# Altium schematic sheet other.SchDoc
size A3
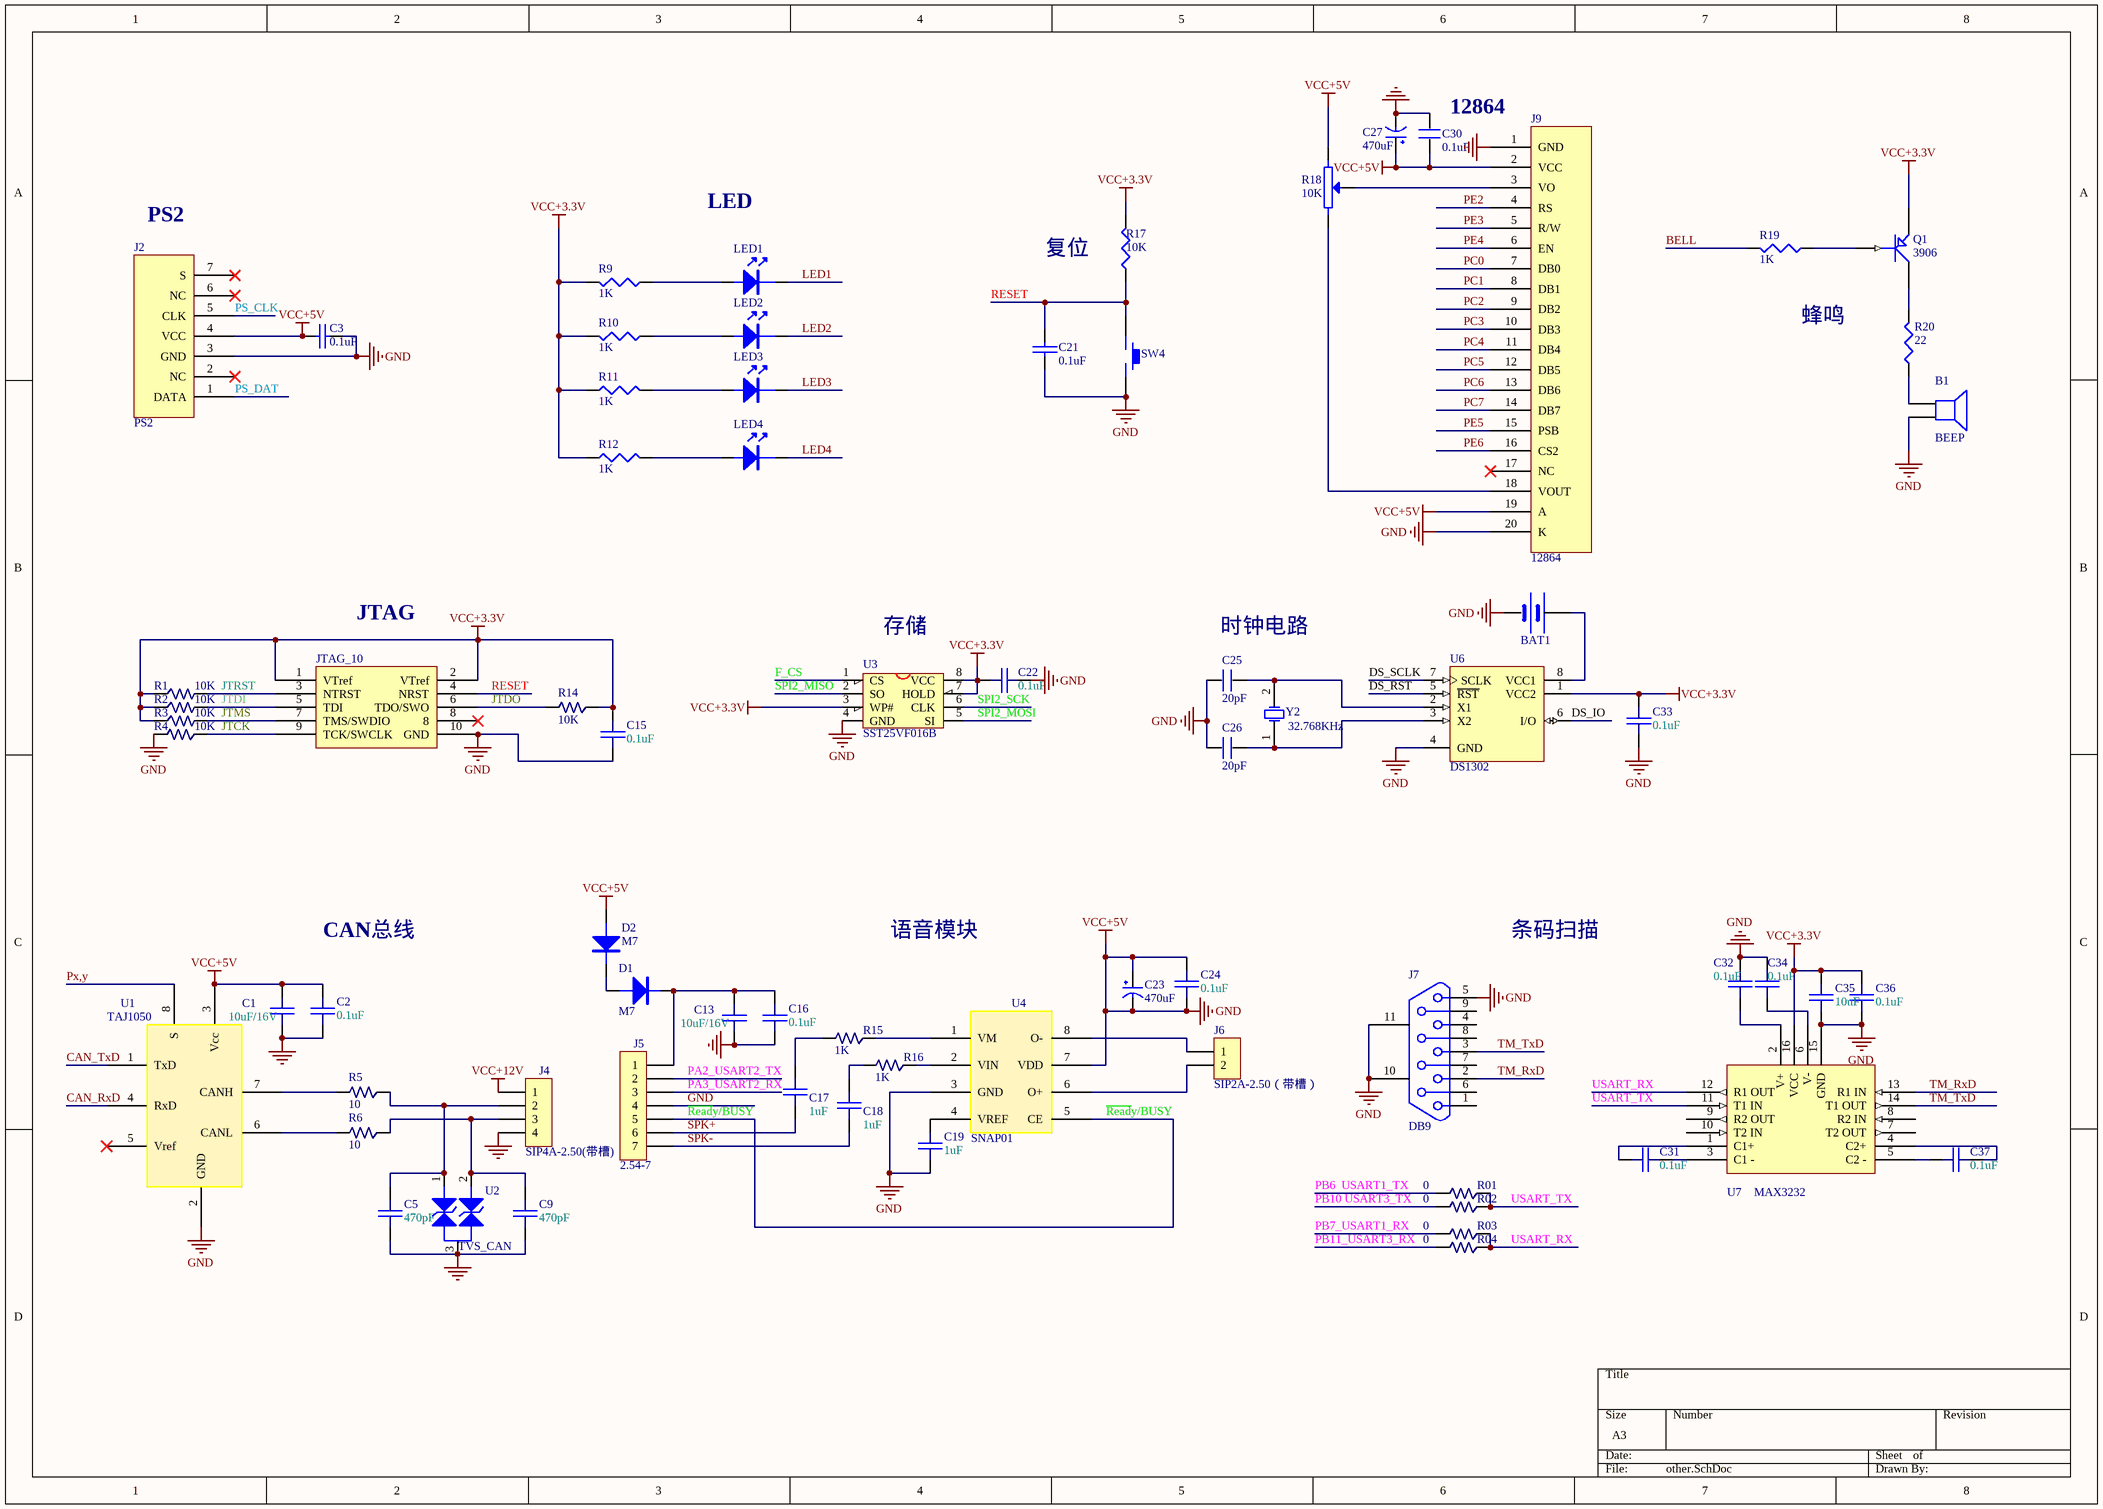
[diagram p0: other.SchDoc]

## Parts
B1  BEEP  [BEEP-12]
BAT1  BATT  [BATM]  (value not drawn)
C1  10uF/16V  [0805]
C2  0.1uF  [0603]
C3  0.1uF  [0603]
C5  470pF  [0603]
C9  470pF  [0603]
C13  10uF/16V  [0805]
C15  0.1uF  [0603]
C16  0.1uF  [0603]
C17  1uF  [0603]
C18  1uF  [0603]
C19  1uF  [0603]
C21  0.1uF  [0603]
C22  0.1uF  [0603]
C23  470uF  [RB5.0-8]
C24  0.1uF  [0603]
C25  20pF  [0603]
C26  20pF  [0603]
C27  470uF  [RB5.0-8]
C30  0.1uF  [0603]
C31  0.1uF  [0603]
C32  0.1uF  [0603]
C33  0.1uF  [0603]
C34  0.1uF  [0603]
C35  10uF  [0805]
C36  0.1uF  [0603]
C37  0.1uF  [0603]
D1  M7  [SMB]
D2  M7  [SMB]
J2  PS2  [PS2-6PIN]
J3  JTAG_10  [JTAG_10]
J4  SIP4A-2.50(带槽)  [5.08_4P]
J5  2.54-7  [SYN6288]
J6  SIP2A-2.50（带槽）  [2.54]
J7  DB9  [DB9/M]
J9  12864  [XH2.54-20P]
LED1  (no value)  [LED-0805]
LED2  (no value)  [LED-0805]
LED3  (no value)  [LED-0805]
LED4  (no value)  [LED-0805]
Q1  3906  [SOT-23]
R1  10K  [0603]
R01  0  [0603]
R2  10K  [0603]
R02  0  [0603]
R3  10K  [0603]
R03  0  [0603]
R4  10K  [0603]
R04  0  [0603]
R5  10  [0603]
R6  10  [0603]
R9  1K  [0603]
R10  1K  [0603]
R11  1K  [0603]
R12  1K  [0603]
R14  10K  [0603]
R15  1K  [0603]
R16  1K  [0603]
R17  10K  [0603]
R18  10K  [RM065-V1]
R19  1K  [0603]
R20  22  [0603]
SW4  KEY_M  [KEY_M]  (value not drawn)
U1  TAJ1050  [SO-8]
U2  TVS_CAN  [SOT-23]
U3  SST25VF016B  [SOIC-8]
U4  SNAP01  [sop-8]
U6  DS1302  [SOP-8]
U7  MAX3232  [SOP-16]
Y2  32.768KHz  [cs-308]

## Nets
GND: B1.2 BAT1.2(GND) C1.1 C1.2 C2.1 C2.2 C3.1 C3.2 C5.2 C9.2 C13.1 C15.2 C16.1 C19.2 C21.2 C22.2 C23.1(VCC) C23.2(GND) C24.1 C24.2 C25.1 C26.1 C27.1(VCC) C27.2(GND) C30.1 C30.2 C32.2 C33.1 C34.2 C35.1 C36.1 D2.1(A) J2.3(GND) J2.4(VCC) J3.10(GND) J4.4 J5.4 J7.5 J7.10 J7.11 J9.1(GND) J9.2(VCC) J9.19(A) J9.20(K) R4.2 R18.1 SW4.2 U1.2(GND) U1.3(Vcc) U2.3 U3.4(GND) U4.3(GND) U4.7(VDD) U6.4(GND) U7.15(GND)  [also labelled VCC+5V]
VCC+3.3V: C15.1 C22.1 C33.2 C35.2 C36.2 J3.1(VTref) J3.2(VTref) Q1.2(E) R1.1 R2.1 R3.1 R9.2 R10.2 R11.1 R12.1 R14.1 R17.2 U3.3(WP#) U3.7(HOLD) U3.8(VCC) U6.1(VCC2) U7.16(VCC)
VCC+12V: J4.1
BELL: R19.2
CAN_RxD: U1.4(RxD)
CAN_TxD: U1.1(TxD)
DS_IO: U6.6(I/O)
DS_RST: U6.5(~{RST})
DS_SCLK: U6.7(SCLK)
F_CS: U3.1(CS)
JTCK: J3.9(TCK/SWCLK) R4.1
JTDI: J3.5(TDI) R2.2
JTDO: J3.6(TDO/SWO) R14.2
JTMS: J3.7(TMS/SWDIO) R3.2
JTRST: J3.3(NTRST) R1.2
LED1: LED1.2
LED2: LED2.2
LED3: LED3.2
LED4: LED4.2
PA2_USART2_TX: J5.2
PA3_USART2_RX: J5.3
PB6  USART1_TX: R01.2
PB7_USART1_RX: R03.2
PB10 USART3_TX: R02.2
PB11_USART3_RX: R04.2
PC0: J9.7(DB0)
PC1: J9.8(DB1)
PC2: J9.9(DB2)
PC3: J9.10(DB3)
PC4: J9.11(DB4)
PC5: J9.12(DB5)
PC6: J9.13(DB6)
PC7: J9.14(DB7)
PE2: J9.4(RS)
PE3: J9.5(R/W)
PE4: J9.6(EN)
PE5: J9.15(PSB)
PE6: J9.16(CS2)
PS_CLK: J2.5(CLK)
PS_DAT: J2.1(DATA)
Px,y: U1.8(S)
~{Read}y/BUSY: J5.5 U4.5(CE)
RESET: C21.1 J3.4(NRST) R17.1 SW4.1
SPI2_MISO: U3.2(SO)
SPI2_MOSI: U3.5(SI)
SPI2_SCK: U3.6(CLK)
SPK+: C17.1 J5.6
SPK-: C18.1 J5.7
TM_RxD: J7.2 U7.13(R1_IN)
TM_TxD: J7.3 U7.14(T1_OUT)
USART_RX: R03.1 R04.1 U7.12(R1_OUT)
USART_TX: R01.1 R02.1 U7.11(T1_IN)
NetB1_1: B1.1 R20.1
NetBAT1_1: BAT1.1(VCC) U6.8(VCC1)
NetC5_1: C5.1 J4.2 R5.1 U2.1
NetC9_1: C9.1 J4.3 R6.1 U2.2(K)
NetC13_2: C13.2 C16.2 D1.2(K) J5.1
NetC17_2: C17.2 R15.2
NetC18_2: C18.2 R16.2
NetC19_1: C19.1 U4.4(VREF)
NetC25_2: C25.2 U6.2(X1) Y2.2(OSC2)
NetC26_2: C26.2 U6.3(X2) Y2.1(OSC1)
NetC31_1: C31.1 U7.1(C1+)
NetC31_2: C31.2 U7.3(C1_-)
NetC32_1: C32.1 U7.2(V+)
NetC34_1: C34.1 U7.6(V-)
NetC37_1: C37.1 U7.5(C2_-)
NetC37_2: C37.2 U7.4(C2+)
NetD1_1: D1.1(A) D2.2(K)
NetJ6_1: J6.1 U4.8(O-)
NetJ6_2: J6.2 U4.6(O+)
NetJ9_3: J9.3(VO) R18.2
NetJ9_18: J9.18(VOUT) R18.3
NetLED1_1: LED1.1 R9.1
NetLED2_1: LED2.1 R10.1
NetLED3_1: LED3.1 R11.2
NetLED4_1: LED4.1 R12.2
NetQ1_1: Q1.1(B) R19.1
NetQ1_3: Q1.3(C) R20.2
NetR5_2: R5.2 U1.7(CANH)
NetR6_2: R6.2 U1.6(CANL)
NetR15_1: R15.1 U4.1(VM)
NetR16_1: R16.1 U4.2(VIN)

Not connected (* = marked no-connect by the designer): J2 2(NC)* 6(NC)* 7(S)*; J3 8*; J7 1 4 6 7 8 9; J9 17(NC)*; U1 5(Vref)*; U7 7(T2_OUT) 8(R2_IN) 9(R2_OUT) 10(T2_IN)

## Notes on the sheet
- (near C30) 12864
- (near J2) PS2
- LED
- 复位
- 蜂鸣
- JTAG
- (near U3) 存储
- (near C25) 时钟电路
- CAN总线
- 语音模块
- 条码扫描

## Library data of the parts
B1 = SPEAKER
BAT1 = BAT
C1 C2 C5 C9 C13 C15-C19 C22 C24 C31-C37 = CAP: 陶瓷电容
C3 C21 C23 C27 = CAP
C25 C26 C30 = C
D1 D2 = DIODE
LED1-LED4 = LED
Q1 = PNP1
R1 R01 R2 R02 R3 R03 R4 R04-R6 R14-R16 = RES-1%: 高精度电阻
R9-R12 R17 R19 R20 = RES1
R18 = POT2
U3 = W25X16: W25X16;SST25VF016;MX25L1605
U6 = DS1302: 实时时钟
U7 = MAX232
Y2 = XTAL: Crystal Oscillator; Published: 8-Jun-2000; LatestRevisionDate: 17-Jul-2002; LatestRevisionNote: Re-released for DXP Platform.; Publisher: Altium Limited